# EAGLE schematic esp32-Prototipo_Roger (EAGLE 8.2.2)
CNAME: Simulacare; CREVISION: 1.0.0; DESIGNER: Rinaldo; UNTITLED: Board ESP32
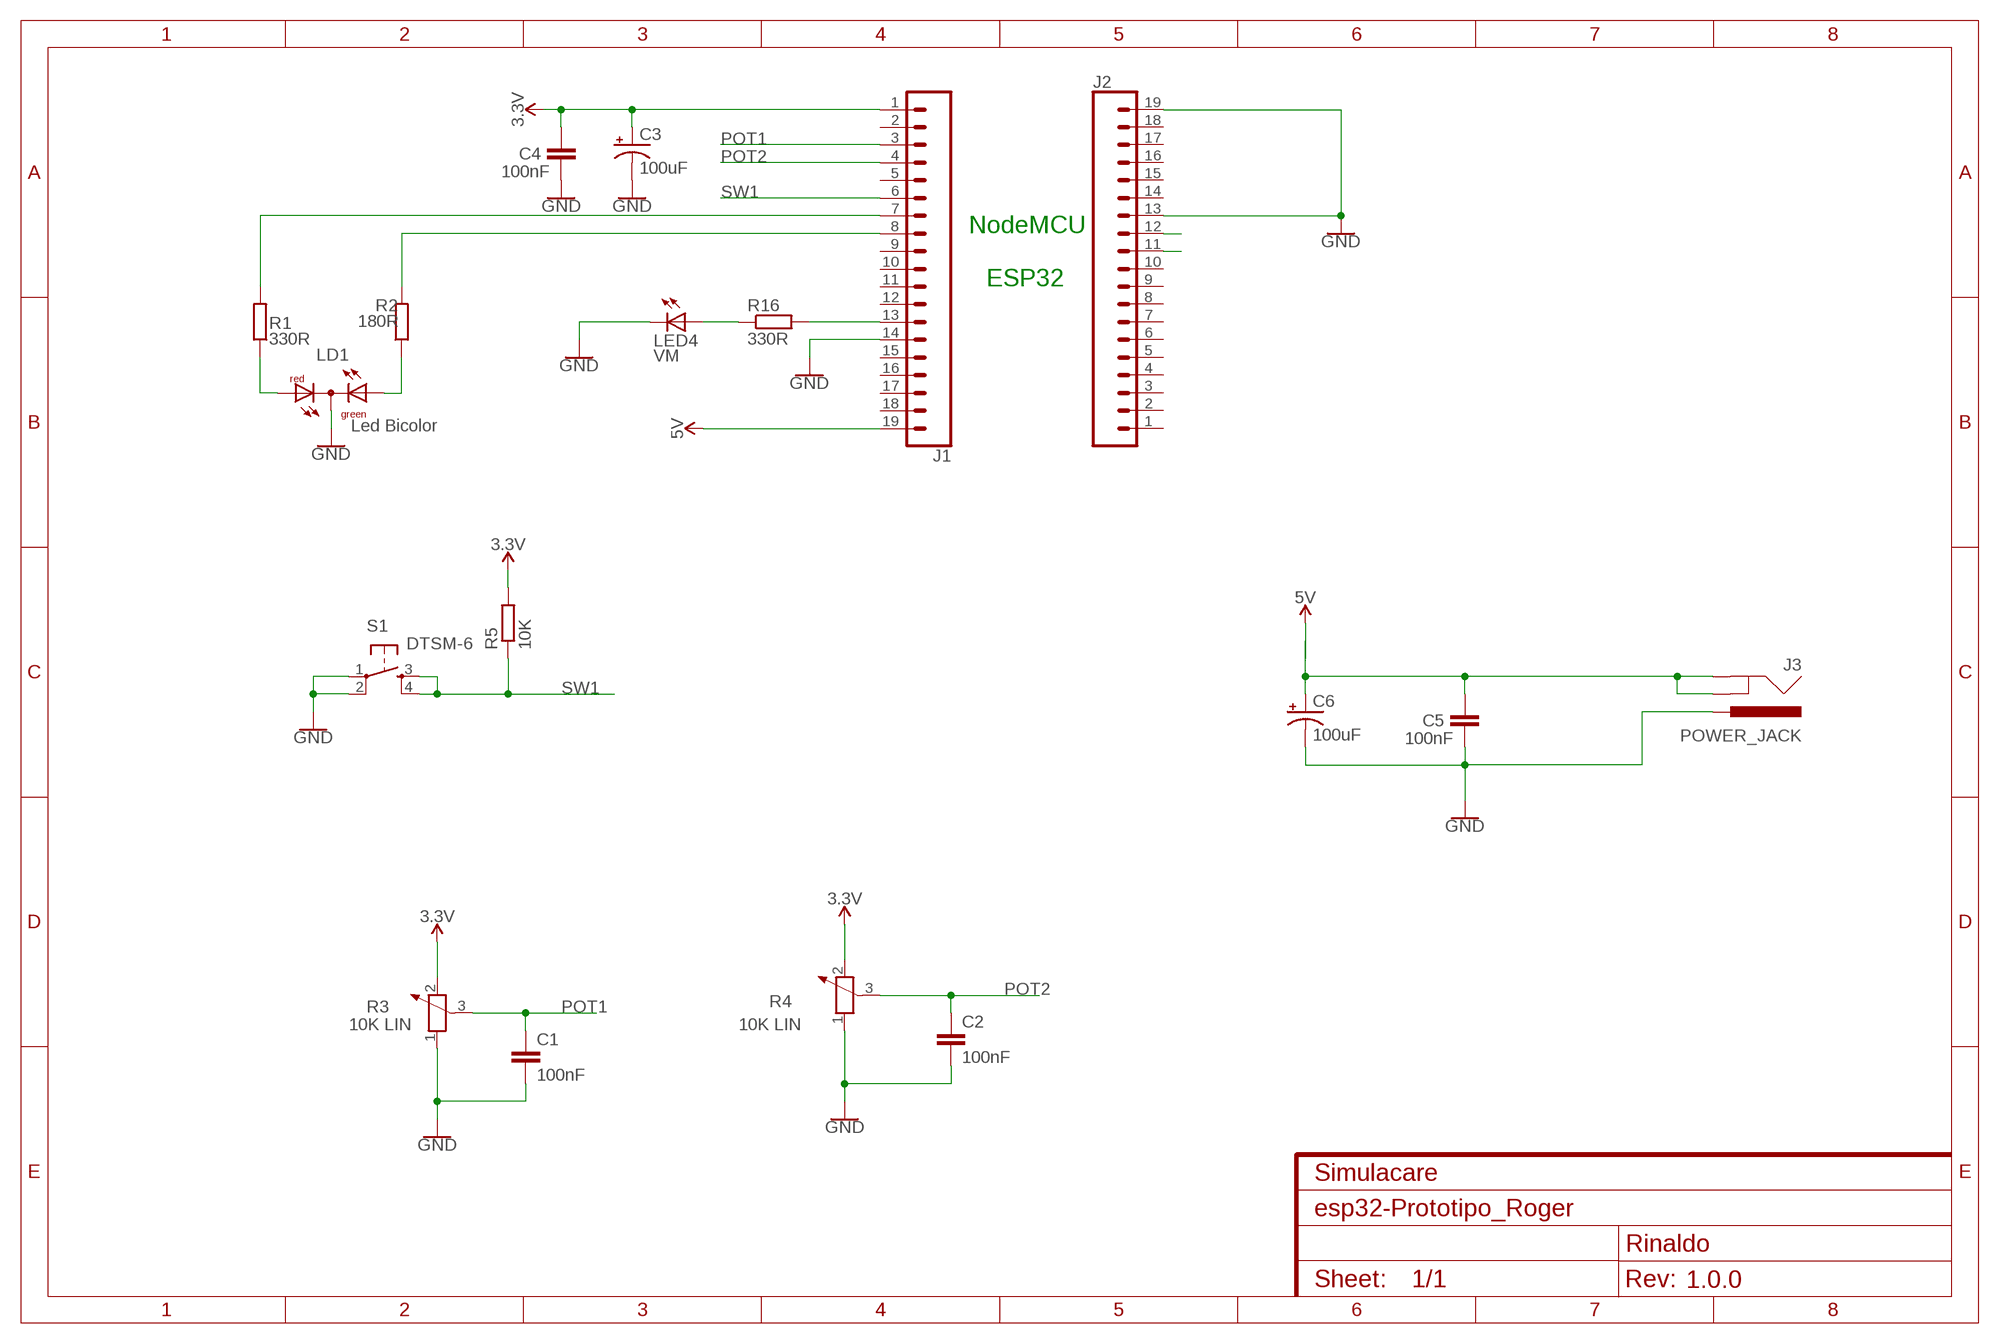
[diagram p0: schematic, sheet 1]

## Parts
C1  100nF  C-EU025-024X044  [C025-024X044]
C2  100nF  C-EU025-024X044  [C025-024X044]
C3  100uF  CPOL-US085CS-1AR  [085CS_1AR]
C4  100nF  C-EU025-024X044  [C025-024X044]
C5  100nF  C-EU025-024X044  [C025-024X044]
C6  100uF  CPOL-US085CS-1AR  [085CS_1AR]
J1  CONN_19  [1X19]
J2  CONN_19  [1X19]
J3  POWER_JACK  [POWER_JACK_PTH]
LD1  Led Bicolor  DUOLED-RG-C  [DUOLED-C-5MM]
LED4  VM  LED5MM  [LED5MM]
R1  330R  R-EU_R0603  [R0603]
R2  180R  R-EU_R0603  [R0603]
R3  10K LIN  POTENTIOMETER_PT-10  [PT-10]
R4  10K LIN  POTENTIOMETER_PT-10  [PT-10]
R5  10K  R-EU_R0603  [R0603]
R16  330R  R-EU_R0603  [R0603]
S1  DTSM-6  [DTSM-6]

## Nets
3.3V: C3.+ C4.1 J1.1 R3.2 R4.2 R5.2
5V: J1.19
CS0: J2.12
CS1: J2.11
GND: C1.2 C2.2 C3.- C4.2 C5.2 C6.- J1.14 J2.13 J2.19 J3.PWR LD1.C LED4.K(C) R3.1 R4.1 S1.1 S1.2
N$1: J1.13 R16.2
N$2: LED4.A R16.1
N$5: J1.8 R2.2
N$7: C5.1 C6.+ J3.GND J3.GNDBREAK
N$8: LD1.AR R1.1
N$9: LD1.AX(AG) R2.1
N$10: J1.7 R1.2
POT1: C1.1 J1.3 R3.3
POT2: C2.1 J1.4 R4.3
SW1: J1.6 R5.1 S1.3 S1.4
Unconnected: J1.2 J1.5 J1.9 J1.10 J1.11 J1.12 J1.15 J1.16 J1.17 J1.18 J2.1 J2.2 J2.3 J2.4 J2.5 J2.6 J2.7 J2.8 J2.9 J2.10 J2.14 J2.15 J2.16 J2.17 J2.18

## Notes on the sheet
- NodeMCU
- ESP32

## Library data of the parts
C1 C2 = rcl:C-EU: CAPACITOR, European symbol
C3 C6 = rcl:CPOL-US: POLARIZED CAPACITOR, American symbol
C4 C5 = resistor:C-EU: CAPACITOR, European symbol
J1 J2 = SparkFun-Connectors:CONN_19: Multi connection point. Often used as Generic Header-pin footprint for 0.1 inch spaced/style header connections On any of the 0.1 inch spaced packages, you can populate with these: Break Away Headers - Straight <https://www.sparkfun.com/products/116> (PRT-00116) Break Away Male Headers - Right Angle <https://www.sparkfun.com/products/553> (PRT-00553) Female Headers <https://www.sparkfun.com/products/115> (PRT-00115) Break Away Headers - Machine Pin <https://www.sparkfun.com/products/117> (PRT-00117) Break Away Female Headers - Swiss Machine Pin <https://www.sparkfun.com/products/743> (PRT-00743) For SCREWTERMINALS and SPRING TERMINALS visit here: Screw Terimnals on SparkFun.com <https://www.sparkfun.com/search/results?term=Screw+Terminals> (5mm/3.5mm/2.54mm spacing) This device is also useful as a general connection point to wire up your design to another part of your project. Our various solder wires solder well into these plated through hole pads. Hook-Up Wire - Assortment (Stranded, 22 AWG) <https://www.sparkfun.com/products/11375> (PRT-11375) Hook-Up Wire - Assortment (Solid Core, 22 AWG) <https://www.sparkfun.com/products/11367> (PRT-11367) View the entire wire category on our website here <https://www.sparkfun.com/categories/141> Special notes: Molex polarized connector foot print use with SKU : PRT-08231 with associated crimp pins and housings. 1MM SMD Version SKU: PRT-10208 NOTES ON THE VARIANTS LOCK and LOCK_LONGPADS... This footprint was designed to help hold the alignment of a through-hole component (i.e. 6-pin header) while soldering it into place. You may notice that each hole has been shifted either up or down by 0.005 of an inch from it's more standard position (which is a perfectly straight line). This slight alteration caused the pins (the squares in the middle) to touch the edges of the holes. Because they are alternating, it causes a "brace" to hold the component in place. 0.005 has proven to be the perfect amount of "off-center" position when using our standard breakaway headers. Although looks a little odd when you look at the bare footprint, once you have a header in there, the alteration is very hard to notice. Also,if you push a header all the way into place, it is covered up entirely on the bottom side.
J3 = SparkFun-Connectors:POWER_JACK: Power Jack Connector This is the standard 5.5mm barrel jack for power. The PTH is the most common, proven, reliable, footprint. The Slot footprint only works if the mill layer is transmitted to the PCB fab house so be warned. Here are the connectors we sell at SparkFun: DC Barrel Power Jack/Connector <https://www.sparkfun.com/products/119> (PRT-00119) DC Barrel Power Jack/Connector (SMD) <https://www.sparkfun.com/products/12748> (PRT-12748) DC Barrel Jack Adapter - Breadboard Compatible <https://www.sparkfun.com/products/10811> (PRT-10811) It is used on this SparkFun product (and many, many others): SparkFun RedBoard - Programmed with Arduino <https://www.sparkfun.com/products/12757> (DEV-12757) Also, if you need a mating power supply or connector, please check these out: Wall Adapter Power Supply - 9VDC 650mA <https://www.sparkfun.com/products/298> (TOL-00298) DC Barrel Jack Adapter - Male <https://www.sparkfun.com/products/10287> (PRT-10287); PROD_ID: CONN-08197
LD1 = led:DUOLED-RG-C: DUO LED 2 colors (red/green), 5 mm, round, common Cathode www.ligitek.com or other producers.
LED4 = adafruit:LED: LED OSRAM: - CHIPLED LG R971, LG N971, LY N971, LG Q971, LY Q971, LO R971, LY R971 LH N974, LH R974 LS Q976, LO Q976, LY Q976 LO Q996 - Hyper CHIPLED LW Q18S LB Q993, LB Q99A, LB R99A - SideLED LS A670, LO A670, LY A670, LG A670, LP A670 LB A673, LV A673, LT A673, LW A673 LH A674 LY A675 LS A676, LA A676, LO A676, LY A676, LW A676 LS A679, LY A679, LG A679 - Hyper Micro SIDELED® LS Y876, LA Y876, LO Y876, LY Y876 LT Y87S - SmartLED LW L88C, LW L88S LB L89C, LB L89S, LG L890 LS L89K, LO L89K, LY L89K LS L896, LA L896, LO L896, LY L896 - TOPLED LS T670, LO T670, LY T670, LG T670, LP T670 LSG T670, LSP T670, LSY T670, LOP T670, LYG T670 LG T671, LOG T671, LSG T671 LB T673, LV T673, LT T673, LW T673 LH T674 LS T676, LA T676, LO T676, LY T676, LB T676, LH T676, LSB T676, LW T676 LB T67C, LV T67C, LT T67C, LS T67K, LO T67K, LY T67K, LW E67C LS E67B, LA E67B, LO E67B, LY E67B, LB E67C, LV E67C, LT E67C LW T67C LS T679, LY T679, LG T679 LS T770, LO T770, LY T770, LG T770, LP T770 LB T773, LV T773, LT T773, LW T773 LH T774 LS E675, LA E675, LY E675, LS T675 LS T776, LA T776, LO T776, LY T776, LB T776 LHGB T686 LT T68C, LB T68C - Hyper Mini TOPLED® LB M676 - Mini TOPLED Santana® LG M470 LS M47K, LO M47K, LY M47K Source: http://www.osram.convergy.de/
R1 R2 R5 R16 = resistor:R-EU_: RESISTOR, European symbol
R3 R4 = rcl:POTENTIOMETER_: Potentiometer
S1 = switch-tact:DTSM-6